# Altium schematic sheet 0805W8F1403T5E1_0805W8F1403T5E.schdoc
size 127 x 99 mm
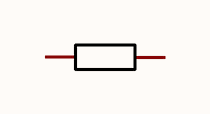
[diagram p0: 0805W8F1403T5E1_0805W8F1403T5E.schdoc]

## Parts
R?  140kΩ  [R0805]  (value not drawn)

## Nets

Not connected (* = marked no-connect by the designer): R? 1 2

## Library data of the parts
R? = 0805W8F1403T5E: Manufacturer: UNI-ROYAL(厚声); Add into BOM: yes; Tolerance: ±1%; Power(Watts): 125mW; Overload Voltage (Max): 150V; Temperature Coefficient: ±100ppm/℃; Symbol: 0805W8F1403T5E; Device: 0805W8F1403T5E; LCSC Part Name: 140kΩ ±1% 125mW 厚膜电阻; Supplier Part: C17460; Manufacturer Part: 0805W8F1403T5E; Supplier Footprint: 0805; JLCPCB Part Class: Extended Part; Datasheet: https://atta.szlcsc.com/upload/public/pdf/source/20200306/C422600_1E6D84923E4A46A82E41ADD87F860B5C.pdf; Supplier: LCSC; Convert to PCB: yes; Type: 厚膜电阻; Value: 140kΩ; Operating Temperature Range: -55℃~+155℃